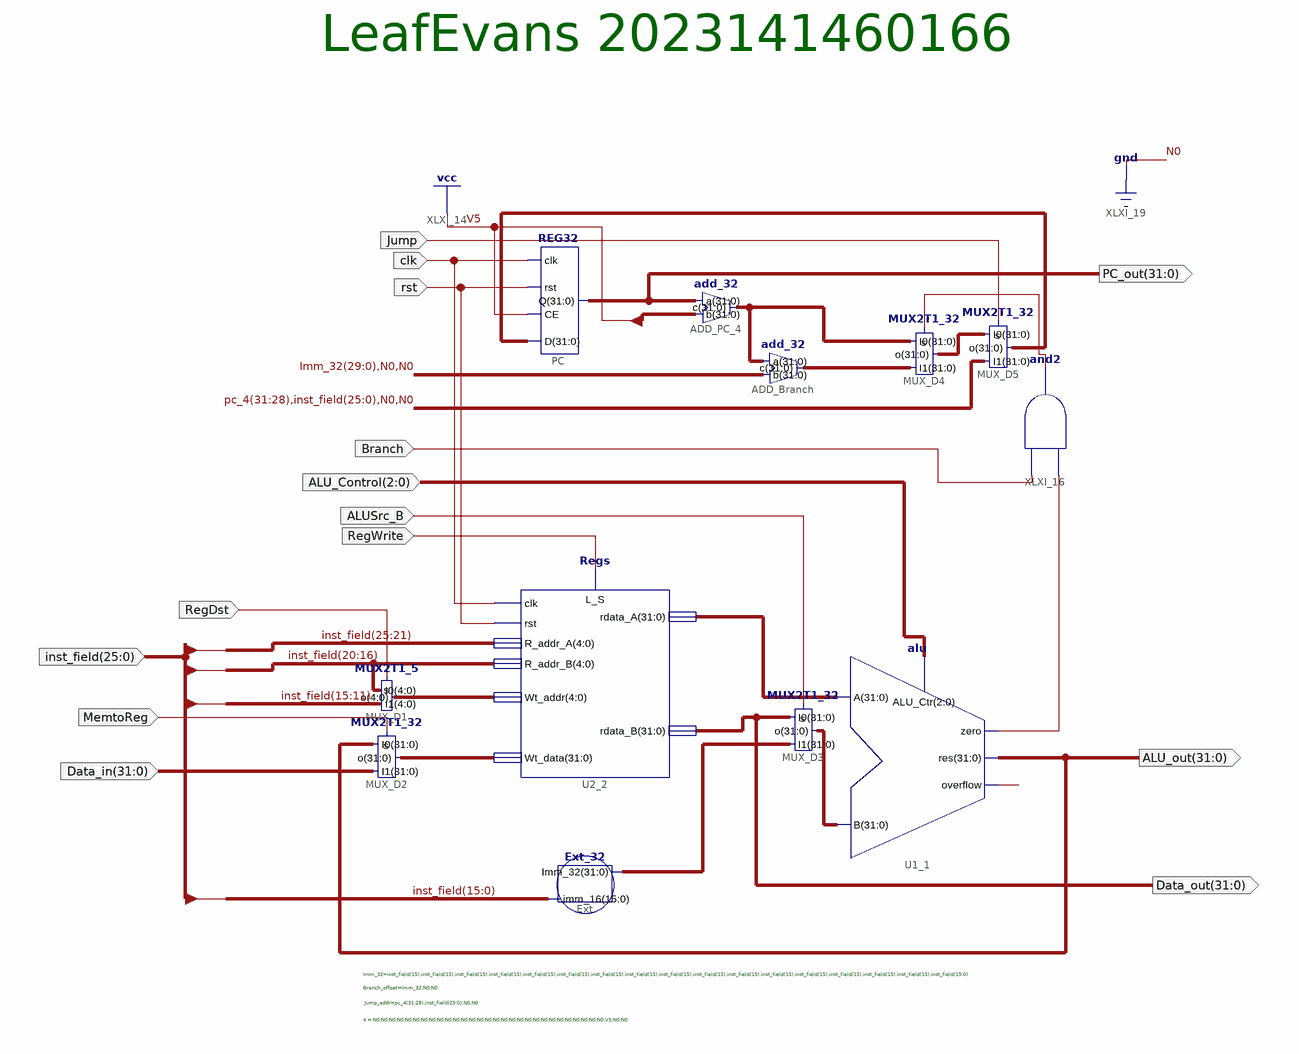
[diagram p0: schematic sheet 1]
// Xilinx ISE schematic SDPath.sch (kintex7) as structural Verilog: 12 symbols, 14 ports
module SDPath (
  input  clk,
  input  rst,
  input  RegWrite,
  input  ALUSrc_B,
  input  Branch,
  input  [2:0] ALU_Control,
  input  [31:0] Data_in,
  input  MemtoReg,
  input  RegDst,
  input  Jump,
  input  [25:0] inst_field,
  output [31:0] Data_out,
  output [31:0] ALU_out,
  output [31:0] PC_out
);

  wire XLXN_43, XLXN_46, XLXN_67;
  wire [4:0] XLXN_20;
  wire [29:0] Imm_32;
  wire [31:0] Branch_addr, pc_4, XLXN_21, XLXN_32, XLXN_44, XLXN_45, XLXN_59, XLXN_60;

  Regs U2_2 (
    .clk(clk), .L_S(RegWrite), .rdata_A(XLXN_45), .rst(rst), .Wt_data(XLXN_21), .rdata_B(Data_out),
    .R_addr_A(inst_field[25:21]), .R_addr_B(inst_field[20:16]), .Wt_addr(XLXN_20));
  Ext_32 Ext (.imm_16(inst_field[15:0]), .Imm_32(XLXN_32));
  REG32 PC (.D(XLXN_59), .CE(1'b1), .rst(rst), .clk(clk), .Q(PC_out));
  MUX2T1_32 MUX_D2 (.s(MemtoReg), .I0(ALU_out), .I1(Data_in), .o(XLXN_21));
  MUX2T1_5 MUX_D1 (.I1(inst_field[15:11]), .I0(inst_field[20:16]), .o(XLXN_20), .s(RegDst));
  MUX2T1_32 MUX_D4 (.s(XLXN_67), .I0(pc_4), .I1(Branch_addr), .o(XLXN_60));
  MUX2T1_32 MUX_D5 (.s(Jump), .I0(XLXN_60), .I1({pc_4[31:28], inst_field, 2'b00}), .o(XLXN_59));
  MUX2T1_32 MUX_D3 (.s(ALUSrc_B), .I0(Data_out), .I1(XLXN_32), .o(XLXN_44));
  add_32 ADD_PC_4 (.b(32'b00000000000000000000000000000100), .a(PC_out), .c(pc_4));
  add_32 ADD_Branch (.b({Imm_32, 2'b00}), .a(pc_4), .c(Branch_addr));
  and XLXI_16 (XLXN_67, XLXN_43, Branch);
  alu U1_1 (.ALU_Ctr(ALU_Control), .res(ALU_out), .zero(XLXN_43), .overflow(XLXN_46), .A(XLXN_45), .B(XLXN_44));

  // Notes on the sheet:
  //   LeafEvans 2023141460166
  //   Imm_32=inst_field(15),inst_field(15),inst_field(15),inst_field(15),inst_field(15),inst_field(15),inst_field(15),inst_field(15),inst_field(15),inst_field(15),inst_field(15),inst_field(15),inst_field(15),inst_field(15),inst_field(15),inst_field(15),inst_field(15:0)
  //   Branch_offset=Imm_32,N0,N0
  //   Jump_addr=pc_4(31:28),inst_field(25:0),N0,N0
  //   4 = N0,N0,N0,N0,N0,N0,N0,N0,N0,N0,N0,N0,N0,N0,N0,N0,N0,N0,N0,N0,N0,N0,N0,N0,N0,N0,N0,N0,N0,V5,N0,N0
endmodule
